# Altium schematic sheet MainBoard_V100_USB_MUX.SchDoc
size A4; SheetNumber: 20; SheetTotal: 22; Title_: USB Multiplexer
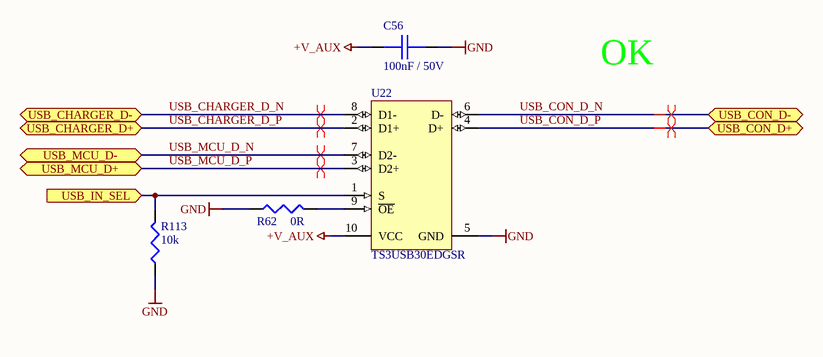
[diagram p0: MainBoard_V100_USB_MUX.SchDoc]

## Parts
C56  100nF / 50V  [0805_C]
R62  0R  [0805]
R113  10k  [0805]
U22  TS3USB30EDGSR  [MSOP-10_P0.5]

## Ports
USB_CHARGER_D+ (bidir), USB_CHARGER_D- (bidir), USB_CON_D+ (bidir), USB_CON_D- (bidir), USB_IN_SEL (in), USB_MCU_D+ (bidir), USB_MCU_D- (bidir)

## Nets
+V_AUX: C56.2 U22.10(VCC)
GND: C56.1 R62.1 R113.1 U22.5(GND)
USB_CHARGER_D_N: U22.8(D1-) ; port USB_CHARGER_D-
USB_CHARGER_D_P: U22.2(D1+) ; port USB_CHARGER_D+
USB_CON_D_N: U22.6(D-) ; port USB_CON_D-
USB_CON_D_P: U22.4(D+) ; port USB_CON_D+
USB_IN_SEL: R113.2 U22.1(S) ; port USB_IN_SEL
USB_MCU_D_N: U22.7(D2-) ; port USB_MCU_D-
USB_MCU_D_P: U22.3(D2+) ; port USB_MCU_D+
NetR62_2: R62.2 U22.9(~{OE})

## Layout directives
differential pair; net class DIFFUSB: USB_CHARGER_D_N, USB_CHARGER_D_P, USB_MCU_D_N, USB_MCU_D_P
differential pair: USB_CON_D_N, USB_CON_D_P

## Notes on the sheet
- OK
- Board:
- Author:
- Title:
- Project:
- SVN:
- Version:
- Sheet:
- of
- Contact:
- Modified:
- Size:
- A4

## Library data of the parts
C56 = 149: 100nF 50V X7R; Part Number: SMD0805-100nF-50V; Azonosító: 149; Category: Passives; Subcategory: PASS_Capacitor; Supplier 1: HESTORE; Supplier 1 order number: 100.011.22
R62 = 38: 0R 0805 0.125W 5%; Part Number: 0 R 5%; Azonosító: 38; Category: Passives; Subcategory: PASS_Resistor; Supplier 1: HESTORE; Supplier 1 order number: 100.275.70
R113 = 59: 10k 0805 0.125W 1%; Part Number: SMD0805-10k 1%; Azonosító: 59; Category: Passives; Subcategory: PASS_Resistor; Supplier 1: HESTORE; Supplier 1 order number: 100.403.38
U22 = 389: High-Speed USB 2.0 (480-Mbps) 1:2 Multiplexer / Demultiplexer Switch with Single, 10 ohm RON, -40 to 85 degC, 10-Pin MSOP; Azonosító: 389; Part Number: TS3USB30EDGSR; Category: Integrated Circuits; Subcategory: IC_Driver; Supplier 1: MOUSER; Supplier 1 order number: 595-TS3USB30EDGSR; Help URL: https://hu.mouser.com/datasheet/2/115/PERI_S_A0000242924_1-2543936.pdf